# EasyEDA Pro project 16V3_EDA.eprj

# Schematic Schematic1
Board Name: Board1; Create Date: 2025-01-20; Page Name: P1; Project Name: 16V3_EDA; Schematic Name: Schematic1; Update Date: 2025-02-12; Company: 嘉立创EDA; Page Size: A4; Version: V1.0
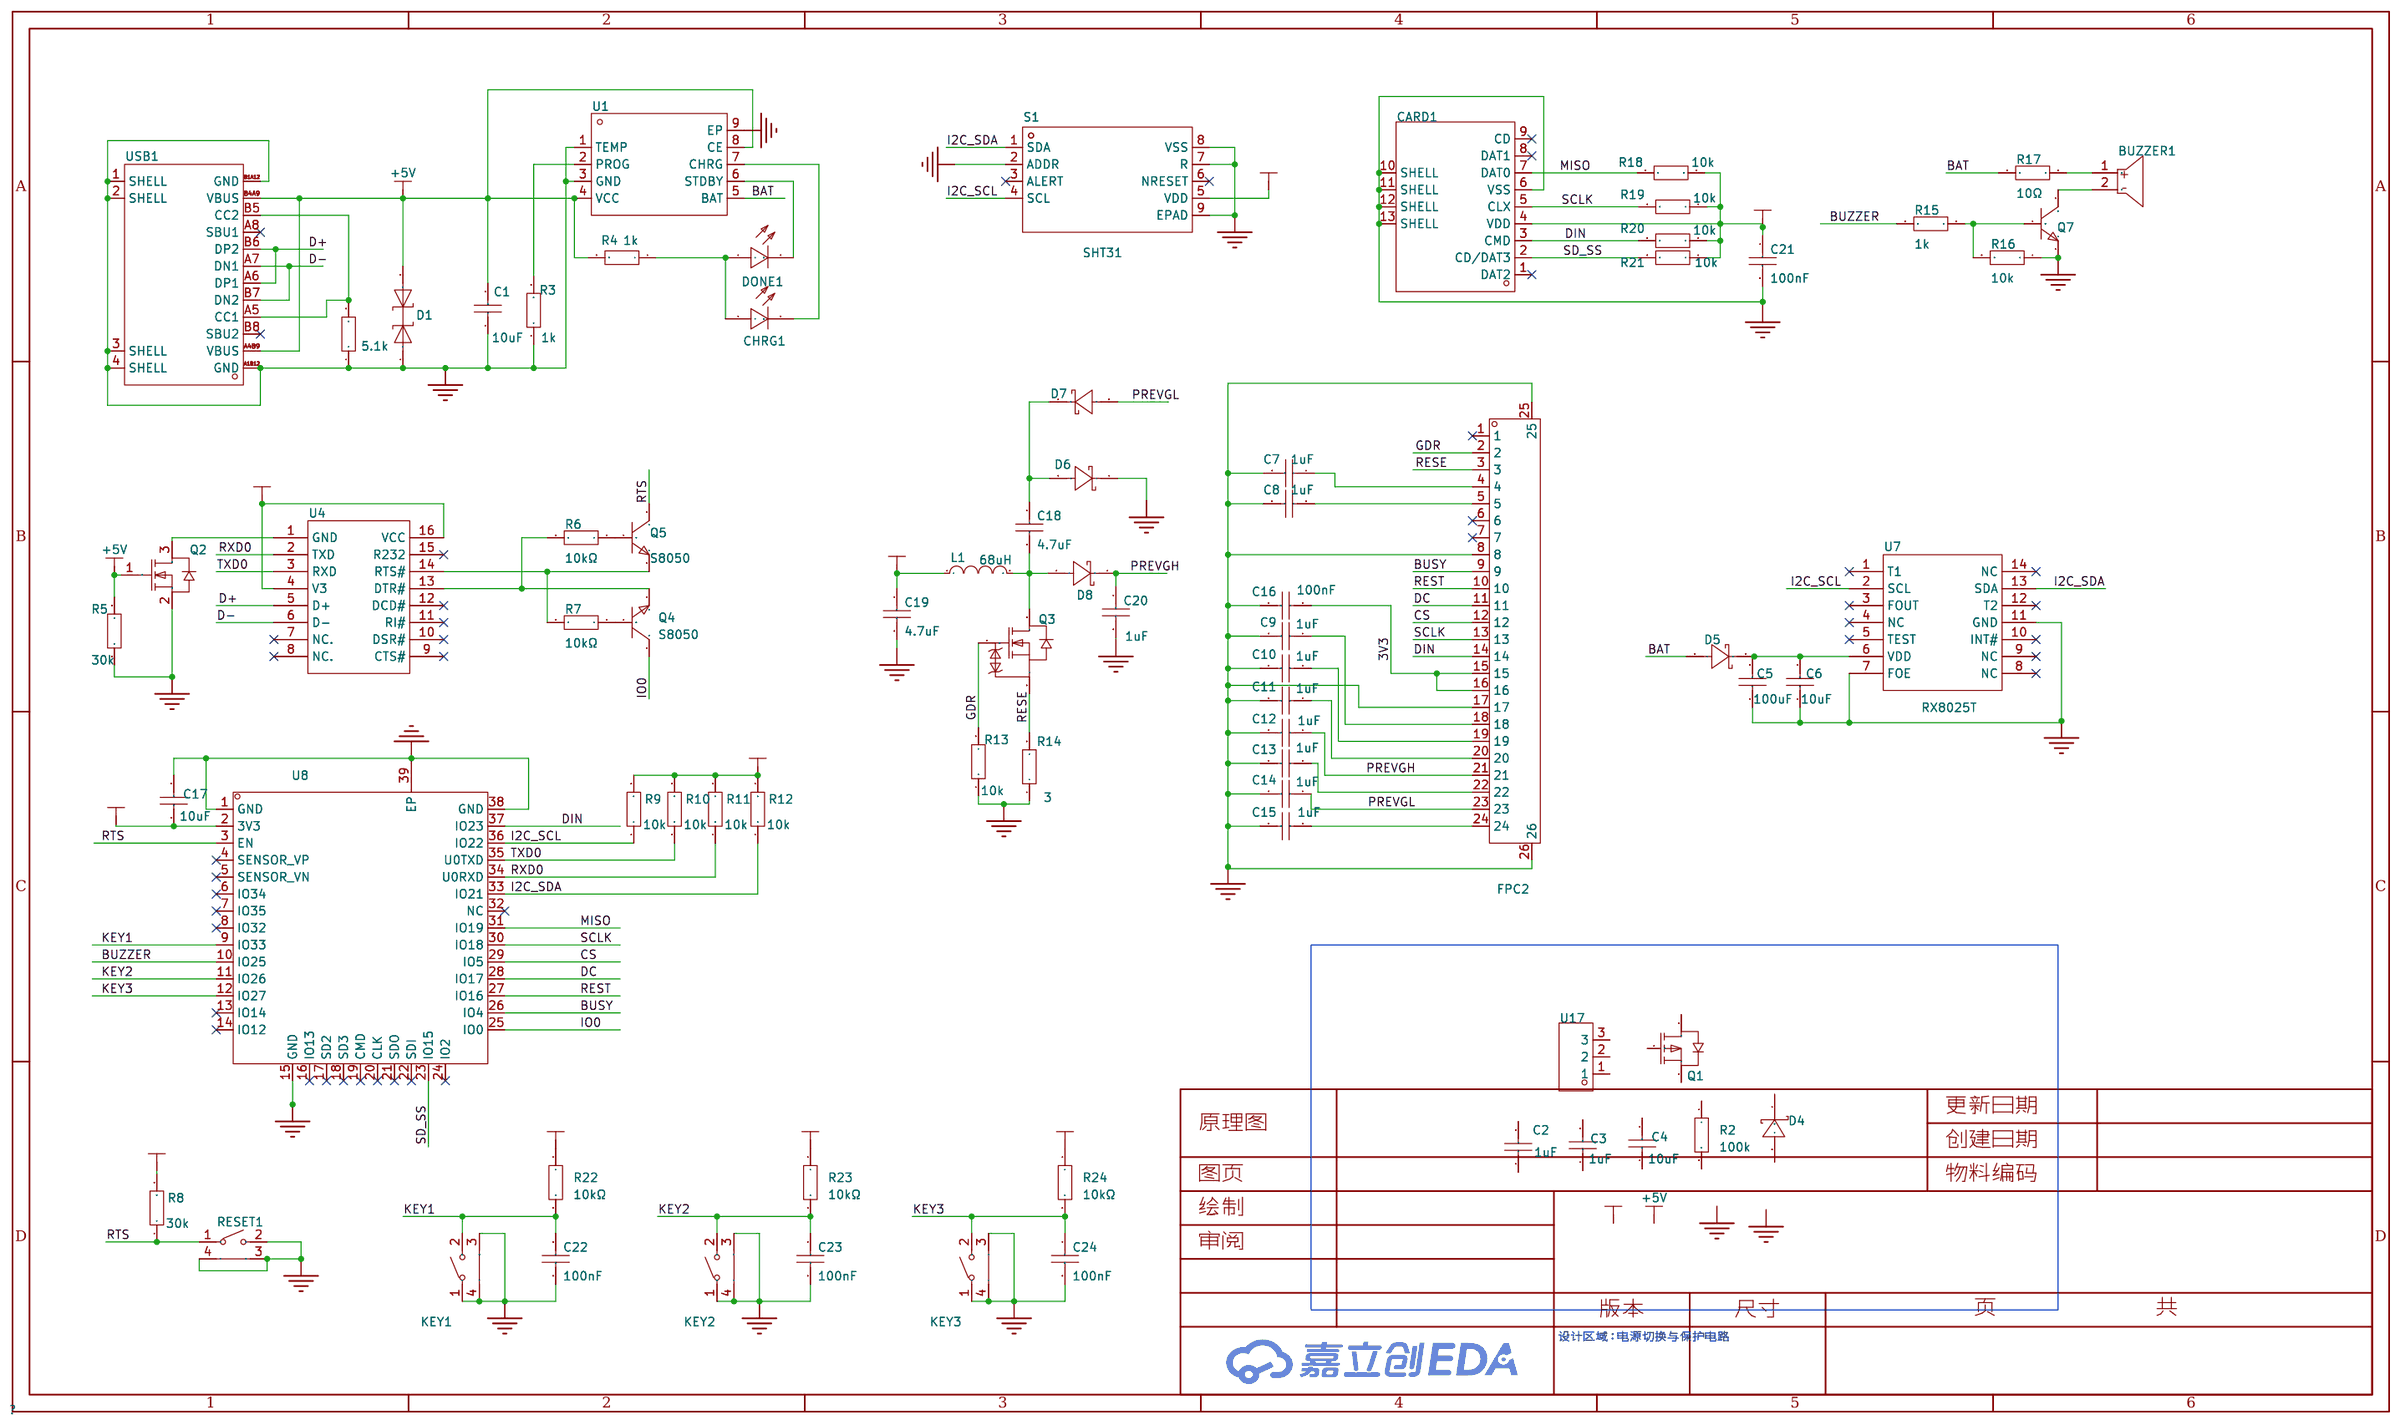
[diagram p0: schematic sheet]

## Parts
BUZZER1  FMQ-BUZZER2  [BUZ-TH_BD12.0-P7.60-D0.6-FD]
C1  10uF  [C0805]
C2  1uF  [C0805]
C3  1uF  [C0805]
C4  10uF  [C0805]
C5  100uF  [C0805]
C6  10uF  [C0805]
C7  1uF  [C0805]
C8  1uF  [C0805]
C9  1uF  [C0805]
C10  1uF  [C0805]
C11  1uF  [C0805]
C12  1uF  [C0805]
C13  1uF  [C0805]
C14  1uF  [C0805]
C15  1uF  [C0805]
C16  100nF  [C0805]
C17  10uF  [C0805]
C18  4.7uF  [C0805]
C19  4.7uF  [C0805]
C20  1uF  [C0805]
C21  100nF  [C0805]
C22  100nF  [C0805]
C23  100nF  [C0805]
C24  100nF  [C0805]
CARD1  -  [TF-SMD_THD2528-11SD-GF]
CHRG1  -  [LED0603-R-RD]
D1  -  [SOD-523_L1.2-W0.8-LS1.6-BI]
D4  -  [SMA_L4.3-W2.6-LS5.1-RD]
D5  -  [SOD-123_L2.7-W1.6-LS3.7-RD-1]
D6  -  [SOD-123_L2.7-W1.6-LS3.7-RD-1]
D7  -  [SOD-123_L2.7-W1.6-LS3.7-RD-1]
D8  -  [SOD-123_L2.7-W1.6-LS3.7-RD-1]
DONE1  -  [LED0603-R-RD]
FPC2  -  [FPC-SMD_24P-L17.5-W5.4-P0.50]
KEY1  -  [SW-SMD_L4.7-W3.5-P3.35-EH]
KEY2  -  [SW-SMD_L4.7-W3.5-P3.35-EH]
KEY3  -  [SW-SMD_L4.7-W3.5-P3.35-EH]
L1  68uH  [IND-SMD_L4.0-W4.0]
Q1  -  [SOT-23_L2.9-W1.3-P1.90-LS2.4-BR]
Q2  -  [SOT-23_L2.9-W1.3-P1.90-LS2.4-BR]
Q3  -  [SOT-323_L2.0-W1.3-P1.30-LS2.1-BR]
Q4  S8050  [SOT-23-3_L3.0-W1.7-P0.95-LS2.9-BR]
Q5  S8050  [SOT-23-3_L3.0-W1.7-P0.95-LS2.9-BR(1)]
Q7  S8050-J3Y  [SOT-23-3_L3.0-W1.7-P0.95-LS2.9-BR]
R1  5.1k  [R0603]
R2  100k  [R0603]
R3  1k  [R0603]
R4  1k  [R0603]
R5  30k  [R0603]
R6  10kΩ  [R0603]
R7  10kΩ  [R0603]
R8  30k  [R0603]
R9  10k  [R0603]
R10  10k  [R0603]
R11  10k  [R0603]
R12  10k  [R0603]
R13  10k  [R0603]
R14  3  [R0603]
R15  1k  [R0603]
R16  10k  [R0603]
R17  10Ω  [R0603]
R18  10k  [R0603]
R19  10k  [R0603]
R20  10k  [R0603]
R21  10k  [R0603]
R22  10kΩ  [R0603]
R23  10kΩ  [R0603]
R24  10kΩ  [R0603]
RESET1  -  [SW-SMD_L4.7-W3.5-P3.35-EH]
S1  SHT31  [DFN-8_L2.5-W2.5-P0.50-BL-EP]
U1  -  [ESOP-8_L4.9-W3.9-P1.27-LS6.0-BL-EP]
U4  -  [SOP-16_L10.0-W3.9-P1.27-LS6.0-BL]
U7  RX8025T  [SOIC-14_L10.0-W5.5-P1.27-LS7.8-BL]
U8  -  [WIRELM-SMD_ESP32-S]
U17  ZX-XH2.54-3PZZ  [CONN-TH_3P-P2.54_2501S-3P]
USB1  -  [USB-SMD_TYPE-611S-T3]

## Library data of the parts
BUZZER1 = FMQ-BUZZER2: Supplier Part: C9900006103; Supplier Footprint: 插件; JLCPCB Part Class: 扩展库; Supplier: LCSC
C1 C4 C6 C17 = CC0805KRX7R9BB104: 容值:100nF;精度:±10%;额定电压:50V;温度系数:X7R;; LCSC Part Name: 100nF ±10% 50V; Supplier Part: C15850; Manufacturer: YAGEO(国巨); Supplier Footprint: 0805; JLCPCB Part Class: Basic Part; Datasheet: https://atta.szlcsc.com/upload/public/pdf/source/20151026/1457707504898.pdf; Supplier: LCSC; Tolerance: ±10%; Voltage Rated: 50V; Temperature Coefficient: X7R
C2 C3 C7-C15 C20 = CC0805KRX7R9BB104: 容值:100nF;精度:±10%;额定电压:50V;温度系数:X7R;; LCSC Part Name: 100nF ±10% 50V; Supplier Part: C15849; Manufacturer: YAGEO(国巨); Supplier Footprint: 0603; JLCPCB Part Class: Basic Part; Datasheet: https://atta.szlcsc.com/upload/public/pdf/source/20151026/1457707504898.pdf; Supplier: LCSC; Tolerance: ±10%; Voltage Rated: 50V; Temperature Coefficient: X7R
C5 C18 = CC0805KRX7R9BB104: 容值:100nF;精度:±10%;额定电压:50V;温度系数:X7R;; LCSC Part Name: 100nF ±10% 50V; Supplier Part: C49678; Manufacturer: YAGEO(国巨); Supplier Footprint: 0805; JLCPCB Part Class: Basic Part; Datasheet: https://atta.szlcsc.com/upload/public/pdf/source/20151026/1457707504898.pdf; Supplier: LCSC; Tolerance: ±10%; Voltage Rated: 50V; Temperature Coefficient: X7R
C16 = CC0805KRX7R9BB104: 容值:100nF;精度:±10%;额定电压:50V;温度系数:X7R;; LCSC Part Name: 100nF ±10% 50V; Supplier Part: C14663; Manufacturer: YAGEO(国巨); Supplier Footprint: 0603; JLCPCB Part Class: Basic Part; Datasheet: https://atta.szlcsc.com/upload/public/pdf/source/20151026/1457707504898.pdf; Supplier: LCSC; Tolerance: ±10%; Voltage Rated: 50V; Temperature Coefficient: X7R
C19 = CC0805KRX7R9BB104: 容值:100nF;精度:±10%;额定电压:50V;温度系数:X7R;; LCSC Part Name: 100nF ±10% 50V; Supplier Part: C19666; Manufacturer: YAGEO(国巨); Supplier Footprint: 0603; JLCPCB Part Class: Basic Part; Datasheet: https://atta.szlcsc.com/upload/public/pdf/source/20151026/1457707504898.pdf; Supplier: LCSC; Tolerance: ±10%; Voltage Rated: 50V; Temperature Coefficient: X7R
C21 = CC0805KRX7R9BB104: 容值:100nF;精度:±10%;额定电压:50V;温度系数:X7R;; LCSC Part Name: 100nF ±10% 50V; Supplier Part: C14663; Manufacturer: YAGEO(国巨); Supplier Footprint: 0805; JLCPCB Part Class: Basic Part; Datasheet: https://atta.szlcsc.com/upload/public/pdf/source/20151026/1457707504898.pdf; Supplier: LCSC; Tolerance: ±10%; Voltage Rated: 50V; Temperature Coefficient: X7R
C22-C24 = CC0805KRX7R9BB104: 容值:100nF;精度:±10%;额定电压:50V;温度系数:X7R;; LCSC Part Name: 100nF ±10% 50V; Supplier Part: C49678; Manufacturer: YAGEO(国巨); Supplier Footprint: 0603; JLCPCB Part Class: Basic Part; Datasheet: https://atta.szlcsc.com/upload/public/pdf/source/20151026/1457707504898.pdf; Supplier: LCSC; Tolerance: ±10%; Voltage Rated: 50V; Temperature Coefficient: X7R
CARD1 = THD2528-11SD-GF: 卡连接方式:自弹式;卡类型:MicroSD卡(TF卡);连接器类型:卡座;本体最大高度:2mm;工作温度范围:-;; LCSC Part Name: 自弹式 MicroSD卡(TF卡) 卡座 外焊; Supplier Part: C283232; Manufacturer: THD(台华达); Supplier Footprint: SMD; Datasheet: https://atta.szlcsc.com/upload/public/pdf/source/20190329/C283232_532F94C79FB51CC42613BF324E8B5690.pdf; Supplier: LCSC; Card Connection Mode: 自弹式; Card Type: MicroSD卡(TF卡); Connector Type: 卡座; Maximum Body Height: 2mm; JLCPCB Part Class: Extended Part
CHRG1 = 19-217/R6C-AL1M2VY/3T: 发光颜色:红灯;二极管配置:-;透镜颜色:无色透明;主波长:617.5nm;峰值波长:632nm;色温:-;光通量(25时):-;测试电流:5mA;正向电压(VF):2.2V;发光强度:28.5mcd;功率:60mW;发光角度:120°;安装方式:-;工作温度:-40~+85;; LCSC Part Name: 0603 红灯; Supplier Part: C2286; Manufacturer: EVERLIGHT(台湾亿光); Supplier Footprint: 0603; Datasheet: https://atta.szlcsc.com/upload/public/pdf/source/20160507/1462613613821.pdf; Supplier: LCSC; Emitted Color: 红灯; Lens Color: 无色透明; Dominant Wavelength: 617.5nm; Peak Wavelength: 632nm; Forward Current: 5mA; Forward Voltage (VF): 2.2V; Luminous Intensity: 28.5mcd; Power Dissipation: 60mW; Viewing Angle: 120°; Operating Temperature: -40~+85; JLCPCB Part Class: Extended Part
D1 = ESD5Z5.0VC: 极性:双向;反向截止电压(Vrwm):5V@(最大值);击穿电压(最小值):5.6V;峰值脉冲电流(Ipp)@10/1000s:4A;最大钳位电压:12V;; LCSC Part Name: 双向 5V@(最大值); Supplier Part: C261278; Manufacturer: TC(德昌); Supplier Footprint: SOD-523; Datasheet: https://atta.szlcsc.com/upload/public/pdf/source/20180801/C261278_4236068C2349B5255C3720AC1205D526.pdf; Supplier: LCSC; Polarity: 双向; Reverse Stand-Off Voltage (Vrwm): 5V@(最大值); Breakdown Voltage (Min): 5.6V; Peak Pulse Current (Ipp)@10/1000μs: 4A; Maximum Clamping Voltage: 12V; JLCPCB Part Class: Extended Part
D4 = SS34: 直流反向耐压(Vr):40V;平均整流电流(Io):3A;正向压降(Vf):550mV@3A;; LCSC Part Name: 40V 3A 550mV@3A (SMA打扁); Supplier Part: C355267; Manufacturer: SINO-IC(光宇睿芯); Supplier Footprint: SMA; Datasheet: https://atta.szlcsc.com/upload/public/pdf/source/20190731/C355267_DFDD47B37D7A4339E7036B819780E55C.pdf; Supplier: LCSC; Reverse Voltage (Vr): 40V; Average Rectified Current (Io): 3A; Forward Voltage (Vf@If): 550mV@3A; JLCPCB Part Class: Extended Part
D5-D8 = MBR0530_C699108: 直流反向耐压(Vr):30V;平均整流电流(Io):500mA;正向压降(Vf):550mV@500mA;; LCSC Part Name: 30V 500mA 550mV@500mA; Supplier Part: C699108; Manufacturer: YANGJIE(扬杰); Manufacturer Part: MBR0530; Supplier Footprint: SOD-123; Datasheet: https://atta.szlcsc.com/upload/public/pdf/source/20200709/C699108_94C8F1A54679DD603C9696C8694A3BC2.pdf; Supplier: LCSC; Reverse Voltage (Vr): 30V; Average Rectified Current (Io): 500mA; Forward Voltage (Vf@If): 550mV@500mA; JLCPCB Part Class: Extended Part
DONE1 = 19-217/R6C-AL1M2VY/3T: 发光颜色:绿灯;二极管配置:-;透镜颜色:无色透明;主波长:617.5nm;峰值波长:632nm;色温:-;光通量(25时):-;测试电流:5mA;正向电压(VF):2.2V;发光强度:28.5mcd;功率:60mW;发光角度:120°;安装方式:-;工作温度:-40~+85;; LCSC Part Name: 0603 红灯; Supplier Part: C72043; Manufacturer: EVERLIGHT(台湾亿光); Supplier Footprint: 0603; Datasheet: https://atta.szlcsc.com/upload/public/pdf/source/20160507/1462613613821.pdf; Supplier: LCSC; Emitted Color: 绿灯; Lens Color: 无色透明; Dominant Wavelength: 617.5nm; Peak Wavelength: 632nm; Forward Current: 5mA; Forward Voltage (VF): 2.2V; Luminous Intensity: 28.5mcd; Power Dissipation: 60mW; Viewing Angle: 120°; Operating Temperature: -40~+85; JLCPCB Part Class: Extended Part
FPC2 = AFC07-S24ECC-00: 间距:0.5mm;触点数量:24;锁定特性:抽屉式;安装类型:卧贴;触点类型:上接;; LCSC Part Name: 0.5mm P数:24 抽屉式 上接; Supplier Part: C11092; Manufacturer: JS(钜硕电子); Supplier Footprint: SMD,P=0.5mm; Datasheet: https://atta.szlcsc.com/upload/public/pdf/source/20151024/1457707484416.pdf; Supplier: LCSC; Pitch: 0.5mm; Number of Contacts: 24; Locking Feature: 抽屉式; Mounting Type: 卧贴; Contact Type: 上接; Height Above Board: 2mm; FFC, FCB Thickness: 0.3mm; JLCPCB Part Class: Extended Part
KEY1-KEY3 RESET1 = GT-TC018B-H0375-L1: 触点电流:50mA;额定电压(DC):12V;绝缘电阻:100MΩ;电路结构:单刀单掷;安装方式:卧贴;按钮形状:矩形按钮;按钮/盖帽颜色:黑色;带灯:无;作用力:250gf@±30gf;机械寿命:100000;工作温度:-30~+85;引脚样式:SMD接片;开关长度:4.7mm;开关宽度:1.9mm;开关高度:3.75mm;带支架:否;; LCSC Part Name: 243.75侧按轻触开关; Supplier Part: C2762970; Manufacturer: G-Switch(品赞); Supplier Footprint: SMD; JLCPCB Part Class: Extended Part; Datasheet: https://atta.szlcsc.com/upload/public/pdf/source/20201201/C963235_1379E8FB9A9D5A830B16F6A18B8D18DC.pdf; Supplier: LCSC; Contact Current: 50mA; Voltage Rating (DC): 12V; Insulation Resistance: 100MΩ; Circuit: 单刀单掷; Mounting Style: 卧贴; Actuator Style: 矩形按钮; Actuator/Cap Color: 黑色; With Lamp: 无; Operating Force: 250gf@±30gf; Mechanical Life: 100000; Operating Temperature: -30~+85; Pin Style: SMD接片; Switch Length: 4.7mm; Switch Width: 1.9mm; Switch Height: 3.75mm; Strike Gundam: 否
L1 = CR4020-680M: 电感值:68uH;精度:±20%;额定电流:-;直流电阻(DCR):-;; LCSC Part Name: 68uH ±20%; Supplier Part: C520318; Manufacturer: ceaiya(柯爱亚); Supplier Footprint: SMD; Datasheet: https://atta.szlcsc.com/upload/public/pdf/source/20200424/C520276_8639ABF18B4A41322D74F24464FD005B.pdf; Supplier: LCSC; Tolerance: ±20%; JLCPCB Part Class: Extended Part
Q1 = SI2305: 类型:P沟道;漏源电压(Vdss):20V;连续漏极电流(Id):4.1A;功率(Pd):1.25W;导通电阻(RDS(on)@Vgs,Id):52m@4.5V,4.1A;阈值电压(Vgs(th)@Id):1V@250A;; LCSC Part Name: P沟道 20V 4.1A; Supplier Part: C344006; Manufacturer: BORN伯恩半导体; Supplier Footprint: SOT-23; Datasheet: https://atta.szlcsc.com/upload/public/pdf/source/20181211/C344006_B14C481D34E4DBCC9865316765F4D8FD.pdf; Supplier: LCSC; Type: P沟道; Drain Source Voltage (Vdss): 20V; Continuous Drain Current (Id): 4.1A; Power Dissipation (Pd): 1.25W; Drain Source On Resistance (RDS(on)@Vgs,Id): 52m@4.5V,4.1A; Gate Threshold Voltage (Vgs(th)@Id): 1V@250A; JLCPCB Part Class: Extended Part
Q2 = AO3402: LCSC Part Name: 场效应管(MOSFET); Supplier Part: C2938369; Manufacturer: GOODWORK(固得沃克); Supplier Footprint: SOT23; JLCPCB Part Class: Extended Part; Datasheet: https://atta.szlcsc.com/upload/public/pdf/source/20211229/104159C48197010484F8CEA4AB274E1B.pdf; Supplier: LCSC
Q3 = SI1308EDL-T1-GE3: 类型:N沟道;漏源电压(Vdss):30V;连续漏极电流(Id):1.4A;功率(Pd):400mW;导通电阻(RDS(on)@Vgs,Id):132m@10V,1.4A;阈值电压(Vgs(th)@Id):1.5V@250A;; LCSC Part Name: N沟道 30V 1.4A; Supplier Part: C469327; Manufacturer: VISHAY(威世); Supplier Footprint: SOT-323; Datasheet: https://atta.szlcsc.com/upload/public/pdf/source/20191217/C469327_3FE8BCBB7604A1B1F6779A1D9DD725BB.pdf; Supplier: LCSC; Type: N沟道; Drain Source Voltage (Vdss): 30V; Continuous Drain Current (Id): 1.4A; Power Dissipation (Pd): 400mW; Drain Source On Resistance (RDS(on)@Vgs,Id): 132m@10V,1.4A; Gate Threshold Voltage (Vgs(th)@Id): 1.5V@250A; JLCPCB Part Class: Extended Part
Q4 = S8050: Pin Type: IN; Supplier: LCSC; Manufacturer: CJ; image: //image.lceda.cn/szlcsc/C2146.jpg; Supplier Part: C2146; JLCPCB Part Class: 基础库
Q5 = S8050: Supplier: LCSC; Manufacturer: CJ; image: //image.lceda.cn/szlcsc/C2146.jpg; Supplier Part: C2146; JLCPCB Part Class: 基础库; JLCPCB SMD: Yes
Q7 = S8050-J3Y: Pin Type: IN; Supplier: LCSC; Supplier Part: C364312; Manufacturer: (MDD) Jiangsu Yutai Elec; JLCPCB Part Class: Extended Part
R1 = TR0603B10K0P0525Z: 电阻类型:薄膜电阻;阻值:10k;精度:±0.1%;功率:100mW;温度系数:±25ppm/;最大工作电压:75V;工作温度范围:-55~+155;; LCSC Part Name: 10k ±0.1% 100mW; Supplier Part: C23186; Manufacturer: EVER OHMS(天二科技); Supplier Footprint: 0603; JLCPCB Part Class: Extended Part; Datasheet: https://atta.szlcsc.com/upload/public/pdf/source/20190415/C188363_433BF05B6FB8F7A0F5F35A3E4390C55A.pdf; Supplier: LCSC; Type: 薄膜电阻; Tolerance: ±0.1%; Power(Watts): 100mW; Temperature Coefficient: ±25ppm/; Overload Voltage (Max): 75V; Operating Temperature Range: -55~+155
R2 = TR0603B10K0P0525Z: 电阻类型:薄膜电阻;阻值:10k;精度:±0.1%;功率:100mW;温度系数:±25ppm/;最大工作电压:75V;工作温度范围:-55~+155;; LCSC Part Name: 10k ±0.1% 100mW; Supplier Part: C25803; Manufacturer: EVER OHMS(天二科技); Supplier Footprint: 0603; JLCPCB Part Class: Extended Part; Datasheet: https://atta.szlcsc.com/upload/public/pdf/source/20190415/C188363_433BF05B6FB8F7A0F5F35A3E4390C55A.pdf; Supplier: LCSC; Type: 薄膜电阻; Tolerance: ±0.1%; Power(Watts): 100mW; Temperature Coefficient: ±25ppm/; Overload Voltage (Max): 75V; Operating Temperature Range: -55~+155
R3 R4 R15 = TR0603B10K0P0525Z: 电阻类型:薄膜电阻;阻值:10k;精度:±0.1%;功率:100mW;温度系数:±25ppm/;最大工作电压:75V;工作温度范围:-55~+155;; LCSC Part Name: 10k ±0.1% 100mW; Supplier Part: C21190; Manufacturer: EVER OHMS(天二科技); Supplier Footprint: 0603; JLCPCB Part Class: Extended Part; Datasheet: https://atta.szlcsc.com/upload/public/pdf/source/20190415/C188363_433BF05B6FB8F7A0F5F35A3E4390C55A.pdf; Supplier: LCSC; Type: 薄膜电阻; Tolerance: ±0.1%; Power(Watts): 100mW; Temperature Coefficient: ±25ppm/; Overload Voltage (Max): 75V; Operating Temperature Range: -55~+155
R5 R8 = TR0603B10K0P0525Z: 电阻类型:薄膜电阻;阻值:10k;精度:±0.1%;功率:100mW;温度系数:±25ppm/;最大工作电压:75V;工作温度范围:-55~+155;; LCSC Part Name: 10kΩ ±0.1% 100mW; Supplier Part: C22984; Manufacturer: EVER OHMS(天二科技); Supplier Footprint: 0603; JLCPCB Part Class: Extended Part; Datasheet: https://atta.szlcsc.com/upload/public/pdf/source/20190415/C188363_433BF05B6FB8F7A0F5F35A3E4390C55A.pdf; Supplier: LCSC; Type: 薄膜电阻; Tolerance: ±0.1%; Power(Watts): 100mW; Temperature Coefficient: ±25ppm/; Overload Voltage (Max): 75V; Operating Temperature Range: -55~+155
R6 R7 = TR0603B10K0P0525Z: 电阻类型:薄膜电阻;阻值:10k;精度:±0.1%;功率:100mW;温度系数:±25ppm/;最大工作电压:75V;工作温度范围:-55~+155;; LCSC Part Name: 10kΩ ±0.1% 100mW; Supplier Part: C188363; Manufacturer: EVER OHMS(天二科技); Supplier Footprint: 0603; JLCPCB Part Class: Extended Part; Datasheet: https://atta.szlcsc.com/upload/public/pdf/source/20190415/C188363_433BF05B6FB8F7A0F5F35A3E4390C55A.pdf; Supplier: LCSC; Type: 薄膜电阻; Tolerance: ±0.1%; Power(Watts): 100mW; Temperature Coefficient: ±25ppm/; Overload Voltage (Max): 75V; Operating Temperature Range: -55~+155
R9-R14 R16 R18-R24 = TR0603B10K0P0525Z: 电阻类型:薄膜电阻;阻值:10k;精度:±0.1%;功率:100mW;温度系数:±25ppm/;最大工作电压:75V;工作温度范围:-55~+155;; LCSC Part Name: 10k ±0.1% 100mW; Supplier Part: C188363; Manufacturer: EVER OHMS(天二科技); Supplier Footprint: 0603; JLCPCB Part Class: Extended Part; Datasheet: https://atta.szlcsc.com/upload/public/pdf/source/20190415/C188363_433BF05B6FB8F7A0F5F35A3E4390C55A.pdf; Supplier: LCSC; Type: 薄膜电阻; Tolerance: ±0.1%; Power(Watts): 100mW; Temperature Coefficient: ±25ppm/; Overload Voltage (Max): 75V; Operating Temperature Range: -55~+155
R17 = 0603WAF100JT5E: 电阻类型:厚膜电阻;阻值:10Ω;精度:±1%;功率:100mW;; LCSC Part Name: 10Ω ±1% 100mW; Supplier Part: C22859; Manufacturer: UNI-ROYAL(厚声); Supplier Footprint: 0603; JLCPCB Part Class: Basic Part; Datasheet: https://atta.szlcsc.com/upload/public/pdf/source/20200306/C422600_1E6D84923E4A46A82E41ADD87F860B5C.pdf; Supplier: LCSC; Type: 厚膜电阻; Tolerance: ±1%; Power(Watts): 100mW; Temperature Coefficient: ±400ppm/℃; Overload Voltage (Max): 75V; Operating Temperature Range: -55℃~+155℃
S1 = SHT31-DIS-B: 1-101386-01; Supplier: LCSC; Manufacturer: Sensirion(瑞士盛思锐); Supplier Part: C80862; JLCPCB Part Class: 扩展库; LCSC Part Name: SHT31-DIS-B2.5kS; Supplier Footprint: DFN-8-EP(2.5x2.5); Datasheet: https://atta.szlcsc.com/upload/public/pdf/source/20230202/324039AB95BA3D329FC29BEE4FBFDB91.pdf; Supply Voltage: 2.15V~5.5V
U1 = TP4056: 充电电池的类型:-;电池单元组数:-;最大充电电流:-;充满的电池组电压:-;最大供应电压:-;; Supplier Part: C725790; Manufacturer: UMW(友台半导体); Supplier Footprint: ESOP-8; Datasheet: https://atta.szlcsc.com/upload/public/pdf/source/20211011/37515E71BA298E23D23475482C49633D.pdf; Supplier: LCSC; JLCPCB Part Class: Extended Part
U4 = CH340C: 类型:Transceiver;协议类别:USB 2.0;驱动器/接收器数:-;数据速率:2Mbps;; Supplier Part: C84681; Manufacturer: WCH(南京沁恒); Supplier Footprint: SOP-16_150mil; Datasheet: https://atta.szlcsc.com/upload/public/pdf/source/20200819/C84681_ADBED554CE321879DBD6B1D06488689C.pdf; Supplier: LCSC; Type: Transceiver; Protocol: USB 2.0; Data Rate: 2Mbps; Supply Voltage: 3.3V, 5V; JLCPCB Part Class: Extended Part
U7 = RX8025T-UB: 时钟芯片类型:Clock/Calendar;存储器容量:-;时间格式:HH:MM:SS;日期格式:YY-MM-DD;接口类型:I2C;; LCSC Part Name: RX8025T-UB(X1B000281000400); Supplier Part: C17353; Manufacturer: EPSON(爱普生); Supplier Footprint: SOP-14_208mil; Datasheet: https://atta.szlcsc.com/upload/public/pdf/source/20160318/1458266986300.pdf; Supplier: LCSC; Type: Clock/Calendar; Features: Alarm; Time Format: HH:MM:SS; Date Format: YY-MM-DD; Interface: I2C; Voltage - Supply: 1.8V ~ 5.5V; Current - Timekeeping (Max): 3.4A @ 5V; JLCPCB Part Class: Extended Part
U8 = ESP32-S_1: LCSC Part Name: ESP32-S; Supplier Part: C277944; Manufacturer: Ai-Thinker(安信可); Manufacturer Part: ESP32-S; Supplier Footprint: SMD Module; Datasheet: https://atta.szlcsc.com/upload/public/pdf/source/20211217/F4BEA33E732D6002D10DAED85BBCB52B.pdf; Supplier: LCSC; JLCPCB Part Class: Extended Part
U17 = ZX-XH2.54-3PZZ: 插针结构:1x3P;间距:2.54mm;安装方式:直插;参考系列:XH;总PIN数:3P;排数:1;每排PIN数:3;行距:-;额定电流:3A;触头材质:黄铜;触头镀层:锡;工作温度范围:-25℃~+85℃;; Supplier Part: C7429633; Manufacturer: Megastar(兆星); Supplier Footprint: 插件,P=2.54mm; JLCPCB Part Class: 扩展库; Datasheet: https://atta.szlcsc.com/upload/public/pdf/source/20230619/AE17037A2CFDBE8D9CBA775D61AD0A84.pdf; Supplier: LCSC; Pins Structure: 1x3P; Pitch: 2.54mm; Mounting Style: 直插; Reference Series: XH; Number of Pins: 3P; Number of Rows: 1; Number of PINs Per Row: 3; Current Rating (Max): 3A; Contact Material: 黄铜; Contact Plating: 锡; Operating Temperature Range: -25℃~+85℃
USB1 = TYPE-611S-T3: 连接器类型:Type-C;标准:-;公母:母座;触点数量:16;端口数量:1;安装方式:卧贴;额定电流 - 电源:3A;工作温度范围:-25~+85;; LCSC Part Name: Type-C 母座 卧贴 端子镀金8.94x7.3x3.16mm; Supplier Part: C2874595; Manufacturer: Yuandi(台湾元迪); Supplier Footprint: SMD; JLCPCB Part Class: Extended Part; Datasheet: https://atta.szlcsc.com/upload/public/pdf/source/20210810/BECE640E8A6D64F3BF313A26DC5F68B7.pdf; Supplier: LCSC; Connector Type: Type-C; Gender: 母座; Number of Contacts: 16; Number of Ports: 1; Mounting Style: 卧贴; Current Rating - Power (Max): 3A; Operating Temperature Range: -25~+85

## Nets
3V3: C16.1 C17.1 C19.1 C21.1 CARD1.4(VDD) FPC2.15 FPC2.16 L1.1 R8.2 R9.2 R10.2 R11.2 R12.2 R18.1 R19.1 R20.1 R21.1 R22.1 R23.1 R24.1 S1.5(VDD) U4.4(V3) U4.16(VCC) U8.2(3V3)
+5V: C1.2 D1.2 Q2.1(G) R4.2 R5.2 U1.4(VCC) U1.8(CE) USB1.A4B9(VBUS) USB1.B4A9(VBUS)
GND: C1.1 C5.1 C6.1 C7.2 C8.2 C9.2 C10.2 C11.2 C12.2 C13.2 C14.2 C15.2 C16.2 C17.2 C19.2 C20.2 C21.2 C22.2 C23.2 C24.2 CARD1.6(VSS) CARD1.10(SHELL) CARD1.11(SHELL) CARD1.12(SHELL) CARD1.13(SHELL) D1.1 D6.1(K) FPC2.8 FPC2.17 FPC2.25 FPC2.26 KEY1.1 KEY1.3 KEY1.4 KEY2.1 KEY2.3 KEY2.4 KEY3.1 KEY3.3 KEY3.4 Q2.2(S) Q7.2(E) R1.1 R3.1 R5.1 R13.1 R14.1 R16.1 RESET1.2 RESET1.3 RESET1.4 S1.2(ADDR) S1.7(R) S1.8(VSS) S1.9(EPAD) U1.1(TEMP) U1.3(GND) U1.9(EP) U7.7(FOE) U7.11(GND) U8.1(GND) U8.15(GND) U8.38(GND) U8.39(EP) USB1.1(SHELL) USB1.2(SHELL) USB1.3(SHELL) USB1.4(SHELL) USB1.A1B12(GND) USB1.B1A12(GND)
BAT: D5.2(A) R17.1 U1.5(BAT)
BUSY: FPC2.9 U8.26(IO4)
BUZZER: R15.2 U8.10(IO25)
CS: FPC2.12 U8.29(IO5)
D+: U4.5(D+) USB1.A6(DP1) USB1.B6(DP2)
D-: U4.6(D-) USB1.A7(DN1) USB1.B7(DN2)
DC: FPC2.11 U8.28(IO17)
DIN: CARD1.3(CMD) FPC2.14 R20.2 U8.37(IO23)
GDR: FPC2.2 Q3.1(G) R13.2
I2C_SCL: R9.1 S1.4(SCL) U7.2(SCL) U8.36(IO22)
I2C_SDA: R12.1 S1.1(SDA) U7.13(SDA) U8.33(IO21)
IO0: Q4.3(C) U8.25(IO0)
KEY1: C22.1 KEY1.2 R22.2 U8.9(IO33)
KEY2: C23.1 KEY2.2 R23.2 U8.11(IO26)
KEY3: C24.1 KEY3.2 R24.2 U8.12(IO27)
MISO: CARD1.7(DAT0) R18.2 U8.31(IO19)
PREVGH: C12.1 C20.1 D8.1(K) FPC2.21
PREVGL: C14.1 D7.2(A) FPC2.23
RESE: FPC2.3 Q3.2(S) R14.2
REST: FPC2.10 U8.27(IO16)
RTS: Q5.3(C) R8.1 RESET1.1 U8.3(EN)
RXD0: R11.1 U4.2(TXD) U8.34(U0RXD)
SCLK: CARD1.5(CLX) FPC2.13 R19.2 U8.30(IO18)
SD_SS: CARD1.2(CD/DAT3) R21.2 U8.23(IO15)
TXD0: R10.1 U4.3(RXD) U8.35(U0TXD)
Net-(BUZZER1-1): BUZZER1.1 R17.2
Net-(BUZZER1-2): BUZZER1.2 Q7.3(C)
Net-(C5-2): C5.2 C6.2 D5.1(K) U7.6(VDD)
Net-(C7-1): C7.1 FPC2.4
Net-(C8-1): C8.1 FPC2.5
Net-(C9-1): C9.1 FPC2.18
Net-(C10-1): C10.1 FPC2.19
Net-(C11-1): C11.1 FPC2.20
Net-(C13-1): C13.1 FPC2.22
Net-(C15-1): C15.1 FPC2.24
Net-(C18-1): C18.1 D6.2(A) D7.1(K)
Net-(C18-2): C18.2 D8.2(A) L1.2 Q3.3(D)
Net-(CHRG1-1): CHRG1.1(A) DONE1.1(A) R4.1
Net-(CHRG1-2): CHRG1.2(C) U1.7(CHRG)
Net-(DONE1-2): DONE1.2(C) U1.6(STDBY)
Net-(Q2-3): Q2.3(D) U4.1(GND)
Net-(Q4-1): Q4.1(B) R7.1
Net-(Q4-2): Q4.2(E) R6.2 U4.13(DTR#)
Net-(Q5-1): Q5.1(B) R6.1
Net-(Q5-2): Q5.2(E) R7.2 U4.14(RTS#)
Net-(Q7-1): Q7.1(B) R15.1 R16.2
Net-(R1-2): R1.2 USB1.A5(CC1) USB1.B5(CC2)
Net-(R3-2): R3.2 U1.2(PROG)

Not connected (* = marked no-connect by the designer): C2 1 2; C3 1 2; C4 1 2; CARD1 1(DAT2)* 8(DAT1)* 9(CD)*; D4 1(C) 2(A); FPC2 1* 6* 7*; Q1 1(G) 2(S) 3(D); R2 1 2; S1 3(ALERT)* 6(NRESET)*; U4 7(NC.)* 8(NC.)* 9(CTS#)* 10(DSR#)* 11(RI#)* 12(DCD#)* 15(R232)*; U7 1(T1)* 3(FOUT)* 4(NC)* 5(TEST)* 8(NC)* 9(NC)* 10(INT#)* 12(T2)* 14(NC)*; U8 4(SENSOR_VP)* 5(SENSOR_VN)* 6(IO34)* 7(IO35)* 8(IO32)* 13(IO14)* 14(IO12)* 16(IO13)* 17(SD2)* 18(SD3)* 19(CMD)* 20(CLK)* 21(SDO)* 22(SDI)* 24(IO2)* 32(NC)*; U17 1 2 3; USB1 A8(SBU1)* B8(SBU2)*

## Notes on the sheet
- 设计区域：电源切换与保护电路
